# Altium schematic sheet ZeroCrossDetection.SchDoc
size A4; SheetNumber: 2; SheetTotal: 2
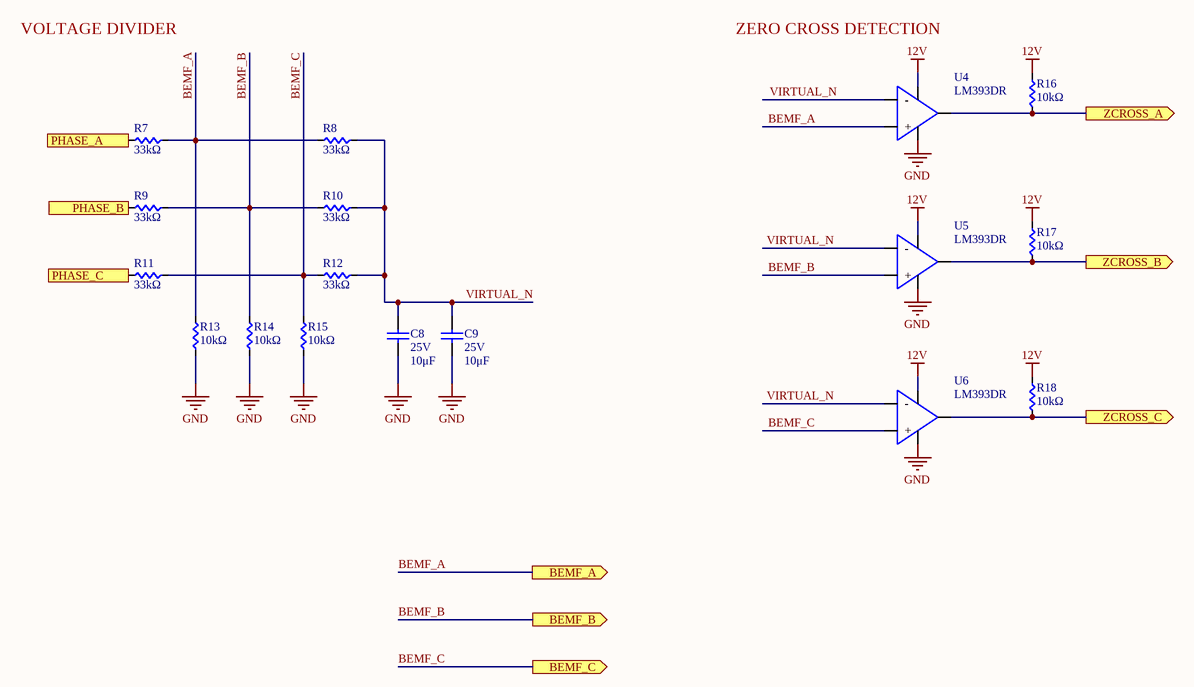
[diagram p0: ZeroCrossDetection.SchDoc]

## Parts
C8  value 10μF  Voltage Rating: 25V  [CAP0603]  (hidden comment: GRM188R61E106MA73J)
C9  value 10μF  Voltage Rating: 25V  [CAP0603]  (hidden comment: GRM188R61E106MA73J)
R7  value 33kΩ  [RES0603]  (hidden comment: RT0603BRD0733KL)
R8  value 33kΩ  [RES0603]  (hidden comment: RT0603BRD0733KL)
R9  value 33kΩ  [RES0603]  (hidden comment: RT0603BRD0733KL)
R10  value 33kΩ  [RES0603]  (hidden comment: RT0603BRD0733KL)
R11  value 33kΩ  [RES0603]  (hidden comment: RT0603BRD0733KL)
R12  value 33kΩ  [RES0603]  (hidden comment: RT0603BRD0733KL)
R13  value 10kΩ  [RES0402]  (hidden comment: RC0402JR-0710KL)
R14  value 10kΩ  [RES0402]  (hidden comment: RC0402JR-0710KL)
R15  value 10kΩ  [RES0402]  (hidden comment: RC0402JR-0710KL)
R16  value 10kΩ  [RES0402]  (hidden comment: RC0402JR-0710KL)
R17  value 10kΩ  [RES0402]  (hidden comment: RC0402JR-0710KL)
R18  value 10kΩ  [RES0402]  (hidden comment: RC0402JR-0710KL)
U4  LM393DR  [SOT25]
U5  LM393DR  [SOT25]
U6  LM393DR  [SOT25]

## Ports
BEMF_A (out, see HBridgeControl[4A]), BEMF_B (out, see HBridgeControl[4A]), BEMF_C (out, see HBridgeControl[4A]), PHASE_A (out, see HBridgeControl[2A], HBridgeControl[3B]), PHASE_B (out, see HBridgeControl[2C], HBridgeControl[3B]), PHASE_C (out, see HBridgeControl[2D], HBridgeControl[3B]), ZCROSS_A (out, see HBridgeControl[3B]), ZCROSS_B (out, see HBridgeControl[3B]), ZCROSS_C (out, see HBridgeControl[3B])

## Nets
12V: R16.2 R17.2 R18.2 U4.5(VCC) U5.5(VCC) U6.5(VCC)
GND: C8.2 C9.2 R13.2 R14.2 R15.2 U4.2(GND) U5.2(GND) U6.2(GND)
BEMF_A: R7.2 R8.1 R13.1 U4.3(+) ; port BEMF_A
BEMF_B: R9.2 R10.1 R14.1 U5.3(+) ; port BEMF_B
BEMF_C: R11.2 R12.1 R15.1 U6.3(+) ; port BEMF_C
PHASE_A: R7.1 ; port PHASE_A
PHASE_B: R9.1 ; port PHASE_B
PHASE_C: R11.1 ; port PHASE_C
VIRTUAL_N: C8.1 C9.1 R8.2 R10.2 R12.2 U4.1(-) U5.1(-) U6.1(-)
ZCROSS_A: R16.1 U4.4(VOUT) ; port ZCROSS_A
ZCROSS_B: R17.1 U5.4(VOUT) ; port ZCROSS_B
ZCROSS_C: R18.1 U6.4(VOUT) ; port ZCROSS_C

## Notes on the sheet
- VOLTAGE DIVIDER
- ZERO CROSS DETECTION

## Library data of the parts
C8 C9 = GRM188R61E106MA73J: CAP CER 10UF 25V X5R 0603; Manufacturer 1: Murata; Manufacturer Part Number 1: GCM21BR71E105KA56L; Supplier 1: Digi-Key; Supplier Part Number 1: 490-4785-1-ND
R7-R12 = RT0603BRD0733KL: RES SMD 33K OHM 0.1% 1/10W 0603; Manufacturer 1: Stackpole Electronics Inc; Manufacturer Part Number 1: RNCP0603FTD10K0; Power Rating: 1/8W; Supplier Part Number 1: RNCP0603FTD10K0CT-ND; Supplier 1: Digi-Key
R13-R18 = RC0402JR-0710KL: RES 10K OHM 5% 1/16W 0402; Manufacturer 1: Stackpole Electronics Inc; Manufacturer Part Number 1: RNCP0603FTD10K0; Power Rating: 1/8W; Supplier Part Number 1: RNCP0603FTD10K0CT-ND; Supplier 1: Digi-Key
U4-U6 = LM393DR: Manufacturer: Texas Instruments; Manufacturer Part Number: LM393DR; Supplier: DigiKey; Supplier Part Number: 296-1015-2-ND